# EAGLE schematic velocimetro1 (EAGLE 5.10)
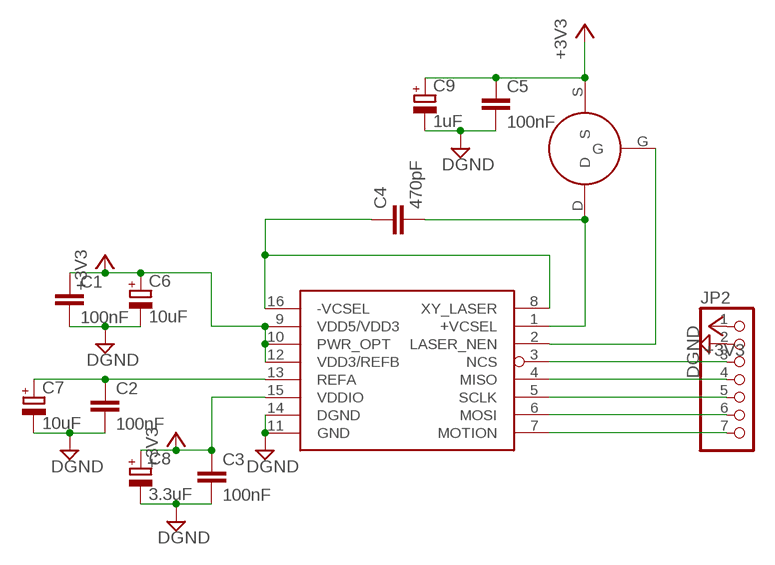
[diagram p0: schematic, sheet 1]

## Parts
C1  100nF  C-EUC0603  [C0603]
C2  100nF  C-EUC0603  [C0603]
C3  100nF  C-EUC0603  [C0603]
C4  470pF  C-EUC0603  [C0603]
C5  100nF  C-EUC0603  [C0603]
C6  10uF  CPOL-EU153CLV-0405  [153CLV-0405]
C7  10uF  CPOL-EU153CLV-0405  [153CLV-0405]
C8  3.3uF  CPOL-EU153CLV-0405  [153CLV-0405]
C9  1uF  CPOL-EU153CLV-0405  [153CLV-0405]
JP2  PINHD-1X7  [1X07]
U$1  ADNS-9500  [ADNS-9500]
U$2  NTA4151P  [SOT416]

## Nets
+3V3: C1.1 C3.1 C5.1 C6.+ C8.+ C9.+ JP2.1 U$1.9(VDD5/VDD3) U$1.10(PWR_OPT) U$1.12(VDD3/REFB) U$1.15(VDDIO) U$2.S
DGND: C1.2 C2.2 C3.2 C5.2 C6.- C7.- C8.- C9.- JP2.2 U$1.11(GND) U$1.14(DGND)
N$1: C2.1 C7.+ U$1.13(REFA)
N$2: JP2.3 U$1.3(NCS)
N$3: JP2.4 U$1.4(MISO)
N$4: JP2.5 U$1.5(SCLK)
N$5: JP2.6 U$1.6(MOSI)
N$6: C4.1 U$1.8(XY_LASER) U$1.16(-VCSEL)
N$7: C4.2 U$1.1(+VCSEL) U$2.D
N$8: JP2.7 U$1.7(MOTION)
N$10: U$1.2(LASER_NEN) U$2.G

## Library data of the parts
C1-C5 = resistor:C-EU: CAPACITOR, European symbol
C6-C9 = resistor:CPOL-EU: POLARIZED CAPACITOR, European symbol
JP2 = pinhead:PINHD-1X7: PIN HEADER
U$1 = mouse:ADNS-9500: Avago Mouse sensor, 150 ips adns-9500; ADNS-9500: mouse sensor
U$2 = mouse:NTA4151P